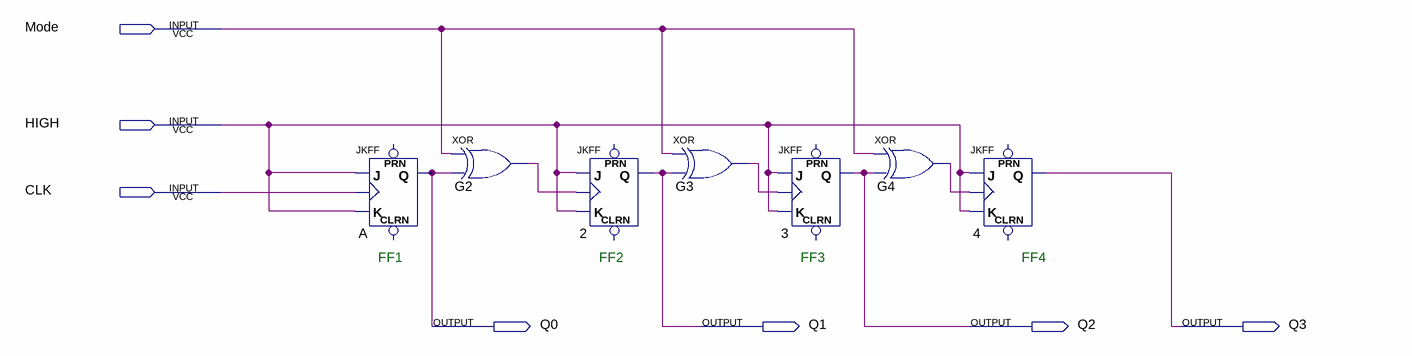
[diagram p0: schematic sheet]
// Quartus schematic snehexp5.bdf as structural Verilog: 7 symbols, 7 pins
module snehexp5 (
  input  Mode,
  input  HIGH,
  input  CLK,
  output Q0,
  output Q1,
  output Q2,
  output Q3
);

  wire G2_out, G3_out, G4_out;

  JKFF A (.K(HIGH), .J(HIGH), .CLK(CLK), .Q(Q0));  // open: PRN, CLRN
  xor G2 (G2_out, Mode, Q0);
  JKFF u_2 (.K(HIGH), .J(HIGH), .CLK(G2_out), .Q(Q1));  // open: PRN, CLRN
  xor G3 (G3_out, Mode, Q1);
  JKFF u_3 (.K(HIGH), .J(HIGH), .CLK(G3_out), .Q(Q2));  // open: PRN, CLRN
  xor G4 (G4_out, Mode, Q2);
  JKFF u_4 (.K(HIGH), .J(HIGH), .CLK(G4_out), .Q(Q3));  // open: PRN, CLRN

  // Notes on the sheet:
  //    FF1  
  //    FF2   
  //    FF3   
  //    FF4   
endmodule
